# Altium schematic sheet MCU2.SchDoc
size A3; DocumentNumber: 1; SheetNumber: 2; SheetTotal: 3
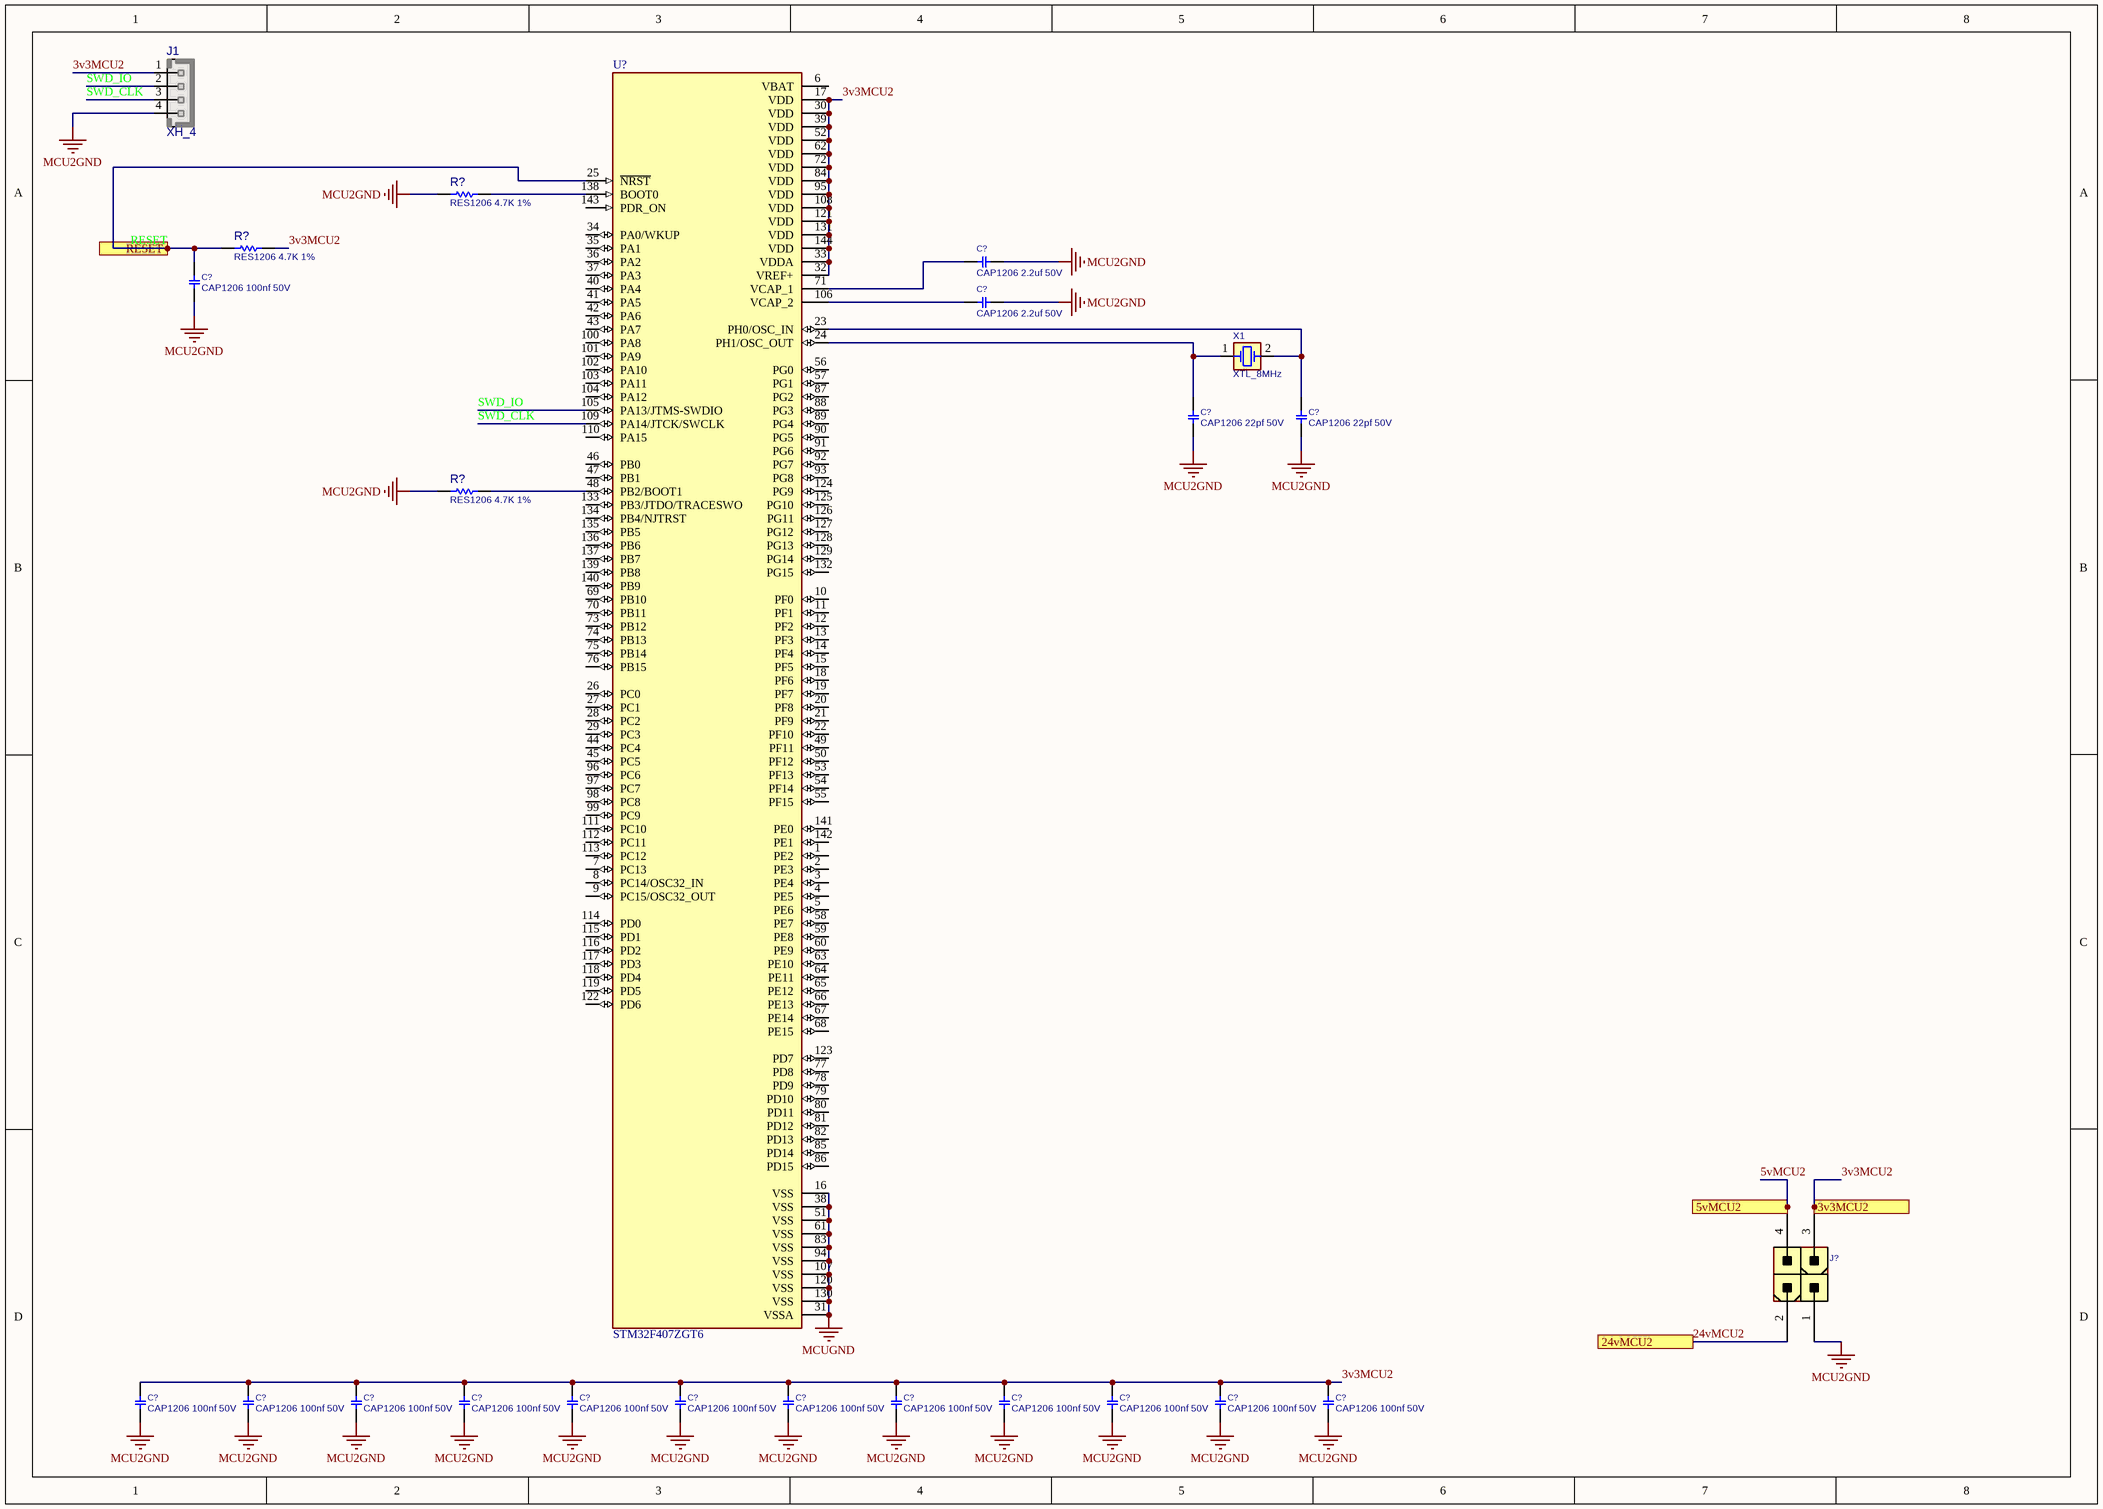
[diagram p0: MCU2.SchDoc]

## Parts
(Parts that share a designator on the sheet are numbered #1, #2 ... from top to bottom, then left to right.)
C?#1  CAP1206 2.2uf 50V  [C1206]
C?#2  CAP1206 100nf 50V  [C1206]
C?#3  CAP1206 2.2uf 50V  [C1206]
C?#4  CAP1206 22pf 50V  [C1206]
C?#5  CAP1206 22pf 50V  [C1206]
C?#6  CAP1206 100nf 50V  [C1206]
C?#7  CAP1206 100nf 50V  [C1206]
C?#8  CAP1206 100nf 50V  [C1206]
C?#9  CAP1206 100nf 50V  [C1206]
C?#10  CAP1206 100nf 50V  [C1206]
C?#11  CAP1206 100nf 50V  [C1206]
C?#12  CAP1206 100nf 50V  [C1206]
C?#13  CAP1206 100nf 50V  [C1206]
C?#14  CAP1206 100nf 50V  [C1206]
C?#15  CAP1206 100nf 50V  [C1206]
C?#16  CAP1206 100nf 50V  [C1206]
C?#17  CAP1206 100nf 50V  [C1206]
J1  XH_4  [XH_4]
J?  CONN_ATXPWR_4  [ATXPWR_4]  (value not drawn)
R?#1  RES1206 4.7K 1%  [R1206]
R?#2  RES1206 4.7K 1%  [R1206]
R?#3  RES1206 4.7K 1%  [R1206]
U?  STM32F407ZGT6  [QFP50P2200X2200X160-144N]
X1  XTL_8MHz  [XTL_2_11X5]

## Ports
3v3MCU2, 5vMCU2, 24vMCU2, RESET

## Nets
MCU2GND: C?#1.1 C?#2.1 C?#3.1 C?#4.1 C?#5.1 C?#6.1 C?#7.1 C?#8.1 C?#9.1 C?#10.1 C?#11.1 C?#12.1 C?#13.1 C?#14.1 C?#15.1 C?#16.1 C?#17.1 J1.4 J?.1 R?#1.2 R?#3.2
MCUGND: U?.16(VSS) U?.31(VSSA) U?.38(VSS) U?.51(VSS) U?.61(VSS) U?.83(VSS) U?.94(VSS) U?.107(VSS) U?.120(VSS) U?.130(VSS)
3v3MCU2: C?#6.2 C?#7.2 C?#8.2 C?#9.2 C?#10.2 C?#11.2 C?#12.2 C?#13.2 C?#14.2 C?#15.2 C?#16.2 C?#17.2 J1.1 J?.3 R?#2.2 U?.17(VDD) U?.30(VDD) U?.32(VREF+) U?.33(VDDA) U?.39(VDD) U?.52(VDD) U?.62(VDD) U?.72(VDD) U?.84(VDD) U?.95(VDD) U?.108(VDD) U?.121(VDD) U?.131(VDD) U?.144(VDD) ; port 3v3MCU2
5vMCU2: J?.4 ; port 5vMCU2
24vMCU2: J?.2 ; port 24vMCU2
RESET: C?#2.2 R?#2.1 U?.25(~{NRST}) ; port RESET
SWD_CLK: J1.3 U?.109(PA14/JTCK/SWCLK)
SWD_IO: J1.2 U?.105(PA13/JTMS-SWDIO)
NetC?#1_2: C?#1.2 U?.71(VCAP_1)
NetC?#3_2: C?#3.2 U?.106(VCAP_2)
NetC?#4_2: C?#4.2 U?.24(PH1/OSC_OUT) X1.1(OSC1)
NetC?#5_2: C?#5.2 U?.23(PH0/OSC_IN) X1.2(OSC2)
NetR?#1_1: R?#1.1 U?.138(BOOT0)
NetR?#3_1: R?#3.1 U?.48(PB2/BOOT1)

Not connected (* = marked no-connect by the designer): U? 1(PE2) 2(PE3) 3(PE4) 4(PE5) 5(PE6) 6(VBAT) 7(PC13) 8(PC14/OSC32_IN) 9(PC15/OSC32_OUT) 10(PF0) 11(PF1) 12(PF2) 13(PF3) 14(PF4) 15(PF5) 18(PF6) 19(PF7) 20(PF8) 21(PF9) 22(PF10) 26(PC0) 27(PC1) 28(PC2) 29(PC3) 34(PA0/WKUP) 35(PA1) 36(PA2) 37(PA3) 40(PA4) 41(PA5) 42(PA6) 43(PA7) 44(PC4) 45(PC5) 46(PB0) 47(PB1) 49(PF11) 50(PF12) 53(PF13) 54(PF14) 55(PF15) 56(PG0) 57(PG1) 58(PE7) 59(PE8) 60(PE9) 63(PE10) 64(PE11) 65(PE12) 66(PE13) 67(PE14) 68(PE15) 69(PB10) 70(PB11) 73(PB12) 74(PB13) 75(PB14) 76(PB15) 77(PD8) 78(PD9) 79(PD10) 80(PD11) 81(PD12) 82(PD13) 85(PD14) 86(PD15) 87(PG2) 88(PG3) 89(PG4) 90(PG5) 91(PG6) 92(PG7) 93(PG8) 96(PC6) 97(PC7) 98(PC8) 99(PC9) 100(PA8) 101(PA9) 102(PA10) 103(PA11) 104(PA12) 110(PA15) 111(PC10) 112(PC11) 113(PC12) 114(PD0) 115(PD1) 116(PD2) 117(PD3) 118(PD4) 119(PD5) 122(PD6) 123(PD7) 124(PG9) 125(PG10) 126(PG11) 127(PG12) 128(PG13) 129(PG14) 132(PG15) 133(PB3/JTDO/TRACESWO) 134(PB4/NJTRST) 135(PB5) 136(PB6) 137(PB7) 139(PB8) 140(PB9) 141(PE0) 142(PE1) 143(PDR_ON)

## Library data of the parts
C?#1-C?#17 = CAP_SMD_MLCC_1206: CAP, MLCC; PARAM: -, -%; MANF_P#: MANF_PART#; PARAM2: -V; PRICE: 100= 1$; MANF: -; ASSEMBLY: ASSEMBLY
J1 = XH_4: PW10-x-M, JST-BxB-XH-A pitch: 2.5mm, 3A/250v; MANF: JST; MANF_P#: B4B-XH-A; PARAM2: 250v; PARAM: 3.0A; VALUE: XH_4
J? = CONN_ATXPWR_4: CONN, ATX POWER, 4 P; MANF: TE, Molex; MANF_P#: 4-1775099-0, 39281043; VALUE: CONN_ATXPWR_4; MountType: THD; PACKAGE: ATXPWR-4pin; Part Type: Conn.
R?#1-R?#3 = RES_SMD_1206: RESISTOR, SMD; PARAM: 1%, 0.25W; DESC: DESCRIPTION; DIST#: MOUSER; MANF_P#: -; MANF: -; ASSEMBLY: ASSEMBLY; PRICE: -; PARAM2: -
U? = STM32F407ZGT6: ARMÂ® CortexÂ®-M4 STM32F4 Microcontroller IC 32-Bit Single-Core 168MHz 1MB (1M x 8) FLASH 144-LQFP (20x20); MF: STMicroelectronics; SnapEDA_Link: https://www.snapeda.com/parts/STM32F407ZGT6/STMicroelectronics/view-part/?ref=snap; Package: LQFP-144 STMicroelectronics; Value: *; MP: STM32F407ZGT6; Check_prices: https://www.snapeda.com/parts/STM32F407ZGT6/STMicroelectronics/view-part/?ref=eda
X1 = XTL_2_HC49_8MHz_SMD: Crystal MOST POPULAR ABL HC49 PACKAGE; MANF: ABRACON; MANF_P#: ABLS-8.000MHZ-B4-T; PARAM: 8MHz, 18pF, 30PPM, -20~70oC; PRICE: 0.3$; VALUE: XTL_8MHz